# Altium schematic sheet BinaryInput2.SchDoc
size A4
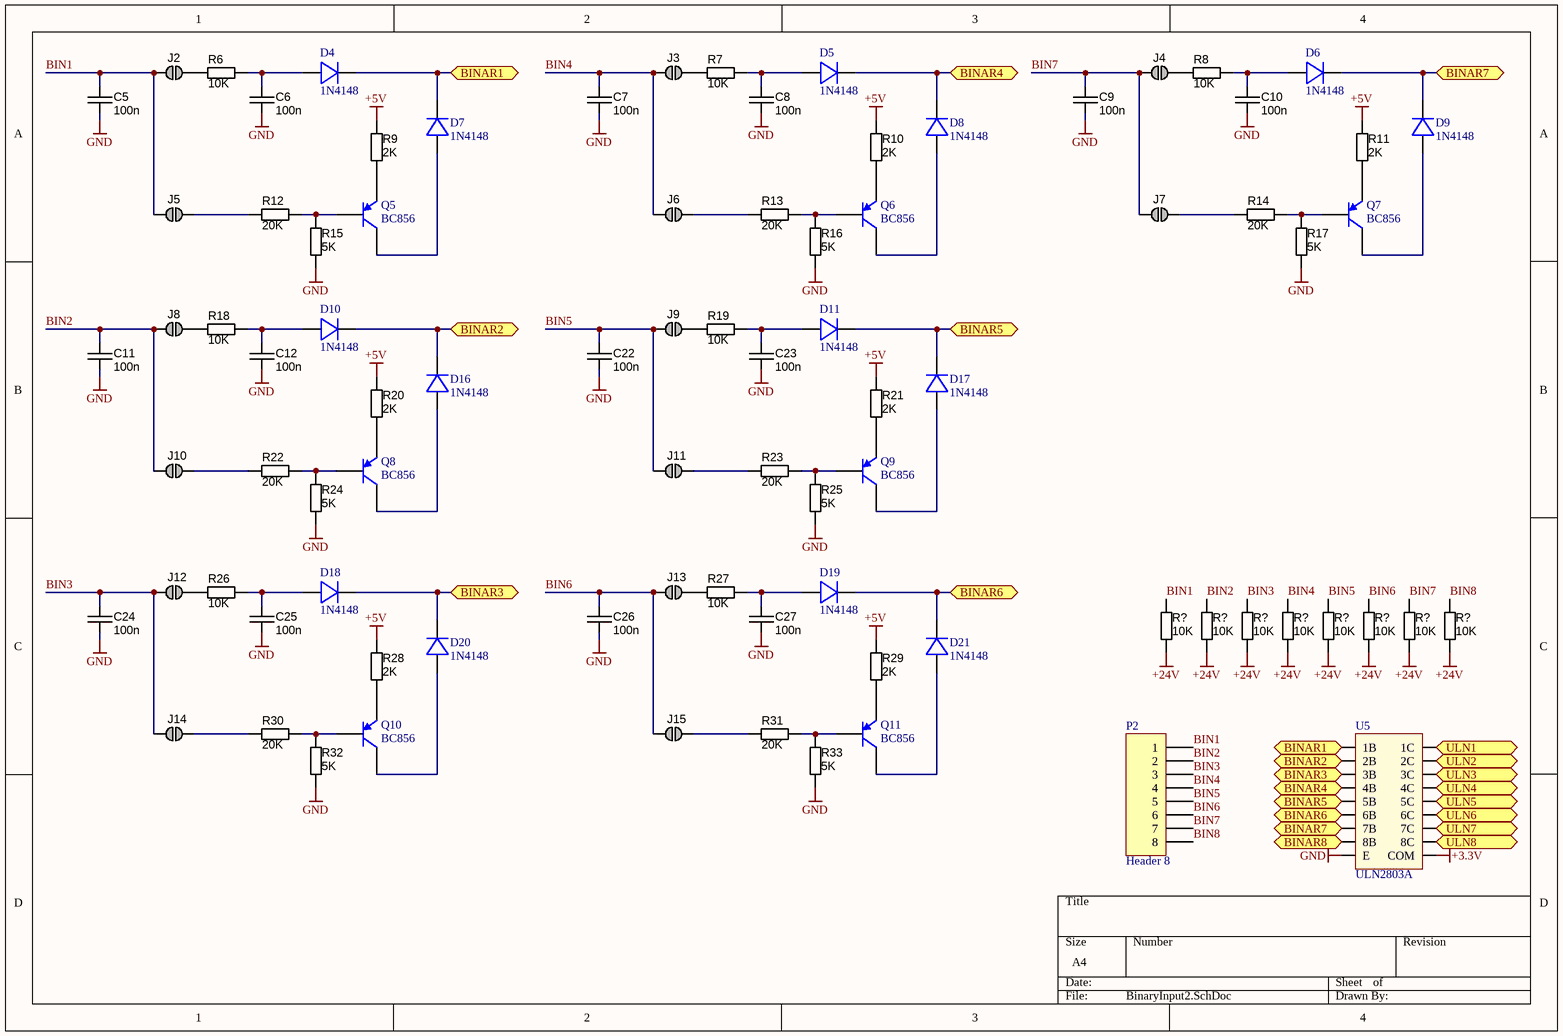
[diagram p0: BinaryInput2.SchDoc]

## Parts
(Parts that share a designator on the sheet are numbered #1, #2 ... from top to bottom, then left to right.)
C5  value 100n  [CAPC2012X135N]  (hidden comment: approved sub OK)
C6  value 100n  [CAPC2012X135N]  (hidden comment: approved sub OK)
C7  value 100n  [CAPC2012X135N]  (hidden comment: approved sub OK)
C8  value 100n  [CAPC2012X135N]  (hidden comment: approved sub OK)
C9  value 100n  [CAPC2012X135N]  (hidden comment: approved sub OK)
C10  value 100n  [CAPC2012X135N]  (hidden comment: approved sub OK)
C11  value 100n  [CAPC2012X135N]  (hidden comment: approved sub OK)
C12  value 100n  [CAPC2012X135N]  (hidden comment: approved sub OK)
C22  value 100n  [CAPC2012X135N]  (hidden comment: approved sub OK)
C23  value 100n  [CAPC2012X135N]  (hidden comment: approved sub OK)
C24  value 100n  [CAPC2012X135N]  (hidden comment: approved sub OK)
C25  value 100n  [CAPC2012X135N]  (hidden comment: approved sub OK)
C26  value 100n  [CAPC2012X135N]  (hidden comment: approved sub OK)
C27  value 100n  [CAPC2012X135N]  (hidden comment: approved sub OK)
D4  1N4148  [SOD-123]
D5  1N4148  [SOD-123]
D6  1N4148  [SOD-123]
D7  1N4148  [SOD-123]
D8  1N4148  [SOD-123]
D9  1N4148  [SOD-123]
D10  1N4148  [SOD-123]
D11  1N4148  [SOD-123]
D16  1N4148  [SOD-123]
D17  1N4148  [SOD-123]
D18  1N4148  [SOD-123]
D19  1N4148  [SOD-123]
D20  1N4148  [SOD-123]
D21  1N4148  [SOD-123]
J2  Jumper  [JUMP1]  (value not drawn)  (no BOM)
J3  Jumper  [JUMP1]  (value not drawn)  (no BOM)
J4  Jumper  [JUMP1]  (value not drawn)  (no BOM)
J5  Jumper  [JUMP1]  (value not drawn)  (no BOM)
J6  Jumper  [JUMP1]  (value not drawn)  (no BOM)
J7  Jumper  [JUMP1]  (value not drawn)  (no BOM)
J8  Jumper  [JUMP1]  (value not drawn)  (no BOM)
J9  Jumper  [JUMP1]  (value not drawn)  (no BOM)
J10  Jumper  [JUMP1]  (value not drawn)  (no BOM)
J11  Jumper  [JUMP1]  (value not drawn)  (no BOM)
J12  Jumper  [JUMP1]  (value not drawn)  (no BOM)
J13  Jumper  [JUMP1]  (value not drawn)  (no BOM)
J14  Jumper  [JUMP1]  (value not drawn)  (no BOM)
J15  Jumper  [JUMP1]  (value not drawn)  (no BOM)
P2  Header 8  [HDR1X8]
Q5  BC856  [SOT-23-3]
Q6  BC856  [SOT-23-3]
Q7  BC856  [SOT-23-3]
Q8  BC856  [SOT-23-3]
Q9  BC856  [SOT-23-3]
Q10  BC856  [SOT-23-3]
Q11  BC856  [SOT-23-3]
R6  value 10K  [RESC2012X70N]  (hidden comment: Thick Film)
R7  value 10K  [RESC2012X70N]  (hidden comment: Thick Film)
R8  value 10K  [RESC2012X70N]  (hidden comment: Thick Film)
R9  value 2K  [RESC2012X70N]  (hidden comment: Thick Film)
R10  value 2K  [RESC2012X70N]  (hidden comment: Thick Film)
R11  value 2K  [RESC2012X70N]  (hidden comment: Thick Film)
R12  value 20K  [RESC2012X70N]  (hidden comment: Thick Film)
R13  value 20K  [RESC2012X70N]  (hidden comment: Thick Film)
R14  value 20K  [RESC2012X70N]  (hidden comment: Thick Film)
R15  value 5K  [RESC2012X70N]  (hidden comment: Thick Film)
R16  value 5K  [RESC2012X70N]  (hidden comment: Thick Film)
R17  value 5K  [RESC2012X70N]  (hidden comment: Thick Film)
R18  value 10K  [RESC2012X70N]  (hidden comment: Thick Film)
R19  value 10K  [RESC2012X70N]  (hidden comment: Thick Film)
R20  value 2K  [RESC2012X70N]  (hidden comment: Thick Film)
R21  value 2K  [RESC2012X70N]  (hidden comment: Thick Film)
R22  value 20K  [RESC2012X70N]  (hidden comment: Thick Film)
R23  value 20K  [RESC2012X70N]  (hidden comment: Thick Film)
R24  value 5K  [RESC2012X70N]  (hidden comment: Thick Film)
R25  value 5K  [RESC2012X70N]  (hidden comment: Thick Film)
R26  value 10K  [RESC2012X70N]  (hidden comment: Thick Film)
R27  value 10K  [RESC2012X70N]  (hidden comment: Thick Film)
R28  value 2K  [RESC2012X70N]  (hidden comment: Thick Film)
R29  value 2K  [RESC2012X70N]  (hidden comment: Thick Film)
R30  value 20K  [RESC2012X70N]  (hidden comment: Thick Film)
R31  value 20K  [RESC2012X70N]  (hidden comment: Thick Film)
R32  value 5K  [RESC2012X70N]  (hidden comment: Thick Film)
R33  value 5K  [RESC2012X70N]  (hidden comment: Thick Film)
R?#1  value 10K  [RESC2012X70N]  (hidden comment: Thick Film)
R?#2  value 10K  [RESC2012X70N]  (hidden comment: Thick Film)
R?#3  value 10K  [RESC2012X70N]  (hidden comment: Thick Film)
R?#4  value 10K  [RESC2012X70N]  (hidden comment: Thick Film)
R?#5  value 10K  [RESC2012X70N]  (hidden comment: Thick Film)
R?#6  value 10K  [RESC2012X70N]  (hidden comment: Thick Film)
R?#7  value 10K  [RESC2012X70N]  (hidden comment: Thick Film)
R?#8  value 10K  [RESC2012X70N]  (hidden comment: Thick Film)
U5  ULN2803A  [SOP18]

## Ports
BINAR1, BINAR2, BINAR3, BINAR4, BINAR5, BINAR6, BINAR7, BINAR8, ULN1, ULN2, ULN3, ULN4, ULN5, ULN6, ULN7, ULN8

## Nets
+3.3V: U5.10(COM)
+5V: R9.2 R10.2 R11.2 R20.2 R21.2 R28.2 R29.2
+24V: R?#1.1 R?#2.1 R?#3.1 R?#4.1 R?#5.1 R?#6.1 R?#7.1 R?#8.1
GND: C5.2 C6.2 C7.2 C8.2 C9.2 C10.2 C11.2 C12.2 C22.2 C23.2 C24.2 C25.2 C26.2 C27.2 R15.1 R16.1 R17.1 R24.1 R25.1 R32.1 R33.1 U5.9(E)
BIN1: C5.1 J2.2 J5.2 P2.1 R?#1.2
BIN2: C11.1 J8.2 J10.2 P2.2 R?#2.2
BIN3: C24.1 J12.2 J14.2 P2.3 R?#3.2
BIN4: C7.1 J3.2 J6.2 P2.4 R?#4.2
BIN5: C22.1 J9.2 J11.2 P2.5 R?#5.2
BIN6: C26.1 J13.2 J15.2 P2.6 R?#6.2
BIN7: C9.1 J4.2 J7.2 P2.7 R?#7.2
BIN8: P2.8 R?#8.2
BINAR1: D4.K D7.K U5.1(1B) ; port BINAR1
BINAR2: D10.K D16.K U5.2(2B) ; port BINAR2
BINAR3: D18.K D20.K U5.3(3B) ; port BINAR3
BINAR4: D5.K D8.K U5.4(4B) ; port BINAR4
BINAR5: D11.K D17.K U5.5(5B) ; port BINAR5
BINAR6: D19.K D21.K U5.6(6B) ; port BINAR6
BINAR7: D6.K D9.K U5.7(7B) ; port BINAR7
BINAR8: U5.8(8B) ; port BINAR8
ULN1: U5.18(1C) ; port ULN1
ULN2: U5.17(2C) ; port ULN2
ULN3: U5.16(3C) ; port ULN3
ULN4: U5.15(4C) ; port ULN4
ULN5: U5.14(5C) ; port ULN5
ULN6: U5.13(6C) ; port ULN6
ULN7: U5.12(7C) ; port ULN7
ULN8: U5.11(8C) ; port ULN8
NetC6_1: C6.1 D4.A R6.2
NetC8_1: C8.1 D5.A R7.2
NetC10_1: C10.1 D6.A R8.2
NetC12_1: C12.1 D10.A R18.2
NetC23_1: C23.1 D11.A R19.2
NetC25_1: C25.1 D18.A R26.2
NetC27_1: C27.1 D19.A R27.2
NetD7_A: D7.A Q5.3(C)
NetD8_A: D8.A Q6.3(C)
NetD9_A: D9.A Q7.3(C)
NetD16_A: D16.A Q8.3(C)
NetD17_A: D17.A Q9.3(C)
NetD20_A: D20.A Q10.3(C)
NetD21_A: D21.A Q11.3(C)
NetJ2_1: J2.1 R6.1
NetJ3_1: J3.1 R7.1
NetJ4_1: J4.1 R8.1
NetJ5_1: J5.1 R12.1
NetJ6_1: J6.1 R13.1
NetJ7_1: J7.1 R14.1
NetJ8_1: J8.1 R18.1
NetJ9_1: J9.1 R19.1
NetJ10_1: J10.1 R22.1
NetJ11_1: J11.1 R23.1
NetJ12_1: J12.1 R26.1
NetJ13_1: J13.1 R27.1
NetJ14_1: J14.1 R30.1
NetJ15_1: J15.1 R31.1
NetQ5_1: Q5.1(B) R12.2 R15.2
NetQ5_2: Q5.2(E) R9.1
NetQ6_1: Q6.1(B) R13.2 R16.2
NetQ6_2: Q6.2(E) R10.1
NetQ7_1: Q7.1(B) R14.2 R17.2
NetQ7_2: Q7.2(E) R11.1
NetQ8_1: Q8.1(B) R22.2 R24.2
NetQ8_2: Q8.2(E) R20.1
NetQ9_1: Q9.1(B) R23.2 R25.2
NetQ9_2: Q9.2(E) R21.1
NetQ10_1: Q10.1(B) R30.2 R32.2
NetQ10_2: Q10.2(E) R28.1
NetQ11_1: Q11.1(B) R31.2 R33.2
NetQ11_2: Q11.2(E) R29.1

## Library data of the parts
C5-C12 C22-C27 = CAPC_100n_0805_X7R_50V_10%: Capacitor SMD Cer 100nF 10% 50V X7R 0805; Manufacturer 1: Kemet; Manufacturer Part Number 1: C0805C104K5RACTU; Ratings: 50V; X7R; Material: ceramic; SCDType: undef; Package / Case: 0805 (2012 metric); Tolerance: ±10%; Supplier 1: Digi-Key; Supplier Part Number 1: 399-1170-1-ND
D4-D11 D16-D21 = D 1N4148: Diode SMD SOD-323
J2-J15 = JUMP1: SMD jumper
P2 = Header 8: Header, 8-Pin; LatestRevisionDate: 17-Jul-2002; LatestRevisionNote: Re-released for DXP Platform.; Publisher: Altium Limited
Q5-Q11 = Q BC856: BJT PNP
R6-R33 R?#1-R?#8 = RES_10K_0805_1%: Resistor SMD chip 10k Ohm 0.125W 1% 0805; Manufacturer 1: Vishay/Dale; Manufacturer Part Number 1: CRCW080510K0FKEA; Ratings: 1/8W; SCDType: spec; Package / Case: 0805 (2012 metric); Supplier 1: Digi-Key; Supplier Part Number 1: 541-10.0KCCT-ND; Material: Thick Film; Tolerance: ±1%
U5 = ULN2803A: Darlington Transistor Arrays; Mouser: 595-ULN2803ADWR